# EAGLE design 6_channel_remote (EAGLE 9.5.1)
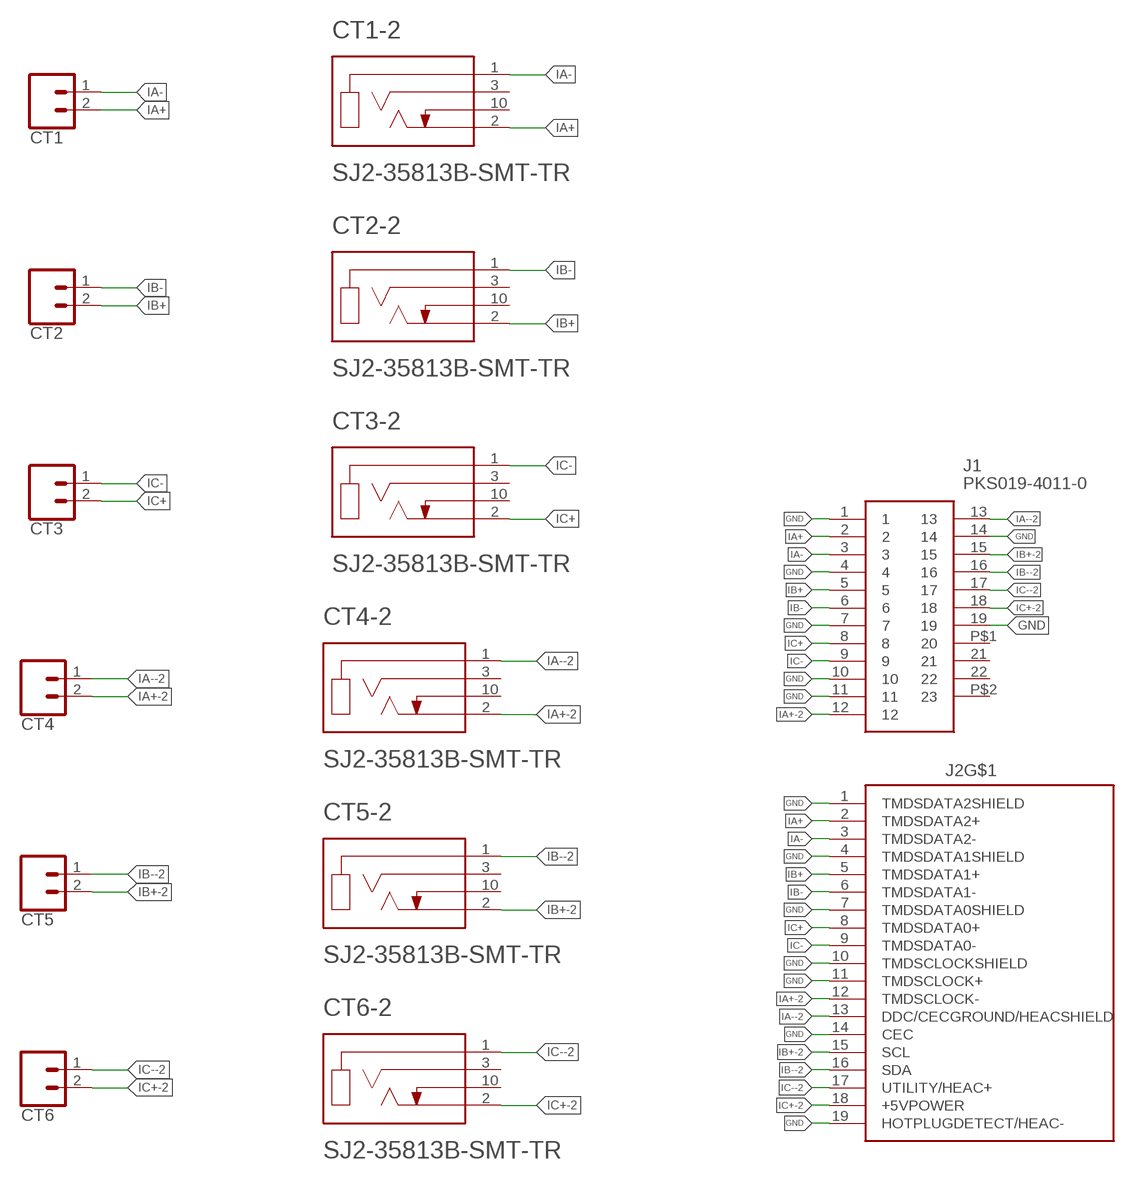
[diagram p0: schematic, sheet 1]

## Parts
CT1  CONN_023.5MM  [SCREWTERMINAL-3.5MM-2]
CT1-2  SJ2-35813B-SMT-TR  [CUI_SJ2-35813B-SMT-TR]
CT2  CONN_023.5MM  [SCREWTERMINAL-3.5MM-2]
CT2-2  SJ2-35813B-SMT-TR  [CUI_SJ2-35813B-SMT-TR]
CT3  CONN_023.5MM  [SCREWTERMINAL-3.5MM-2]
CT3-2  SJ2-35813B-SMT-TR  [CUI_SJ2-35813B-SMT-TR]
CT4  CONN_023.5MM  [SCREWTERMINAL-3.5MM-2]
CT4-2  SJ2-35813B-SMT-TR  [CUI_SJ2-35813B-SMT-TR]
CT5  CONN_023.5MM  [SCREWTERMINAL-3.5MM-2]
CT5-2  SJ2-35813B-SMT-TR  [CUI_SJ2-35813B-SMT-TR]
CT6  CONN_023.5MM  [SCREWTERMINAL-3.5MM-2]
CT6-2  SJ2-35813B-SMT-TR  [CUI_SJ2-35813B-SMT-TR]
J1  PKS019-4011-0  [PKS01940110]
J2  685119136923  [685119136923]

## Nets
GND: J1.1 J1.4 J1.7 J1.10 J1.11 J1.14 J1.19 J2.1(TMDSDATA2SHIELD) J2.4(TMDSDATA1SHIELD) J2.7(TMDSDATA0SHIELD) J2.10(TMDSCLOCKSHIELD) J2.11(TMDSCLOCK+) J2.14(CEC) J2.19(HOTPLUGDETECT/HEAC-)
IA+ [analog]: CT1-2.2(TIP) CT1.2 J1.2 J2.2(TMDSDATA2+)
IA+-2 [analog]: CT4-2.2(TIP) CT4.2 J1.12 J2.12(TMDSCLOCK-)
IA- [analog]: CT1-2.1(SLEEVE) CT1.1 J1.3 J2.3(TMDSDATA2-)
IA--2 [analog]: CT4-2.1(SLEEVE) CT4.1 J1.13 J2.13(DDC/CECGROUND/HEACSHIELD)
IB+ [analog]: CT2-2.2(TIP) CT2.2 J1.5 J2.5(TMDSDATA1+)
IB+-2 [analog]: CT5-2.2(TIP) CT5.2 J1.15 J2.15(SCL)
IB- [analog]: CT2-2.1(SLEEVE) CT2.1 J1.6 J2.6(TMDSDATA1-)
IB--2 [analog]: CT5-2.1(SLEEVE) CT5.1 J1.16 J2.16(SDA)
IC+ [analog]: CT3-2.2(TIP) CT3.2 J1.8 J2.8(TMDSDATA0+)
IC+-2 [analog]: CT6-2.2(TIP) CT6.2 J1.18 J2.18(+5VPOWER)
IC- [analog]: CT3-2.1(SLEEVE) CT3.1 J1.9 J2.9(TMDSDATA0-)
IC--2 [analog]: CT6-2.1(SLEEVE) CT6.1 J1.17 J2.17(UTILITY/HEAC+)
Unconnected: CT1-2.3(RING) CT1-2.10(TIP_SWITCH) CT2-2.3(RING) CT2-2.10(TIP_SWITCH) CT3-2.3(RING) CT3-2.10(TIP_SWITCH) CT4-2.3(RING) CT4-2.10(TIP_SWITCH) CT5-2.3(RING) CT5-2.10(TIP_SWITCH) CT6-2.3(RING) CT6-2.10(TIP_SWITCH) J1.21 J1.22 J1.P$1 J1.P$2 J2.SHELL1(SHIELD) J2.SHELL2(SHIELD) J2.SHELL3(SHIELD) J2.SHELL(SHIELD)

## Library data of the parts
CT1-CT6 = SparkFun-Connectors:CONN_02: Multi connection point. Often used as Generic Header-pin footprint for 0.1 inch spaced/style header connections On any of the 0.1 inch spaced packages, you can populate with these: Break Away Headers - Straight <https://www.sparkfun.com/products/116> (PRT-00116) Break Away Male Headers - Right Angle <https://www.sparkfun.com/products/553> (PRT-00553) Female Headers <https://www.sparkfun.com/products/115> (PRT-00115) Break Away Headers - Machine Pin <https://www.sparkfun.com/products/117> (PRT-00117) Break Away Female Headers - Swiss Machine Pin <https://www.sparkfun.com/products/743> (PRT-00743) For SCREWTERMINALS and SPRING TERMINALS visit here: Screw Terimnals on SparkFun.com <https://www.sparkfun.com/search/results?term=Screw+Terminals> (5mm/3.5mm/2.54mm spacing) This device is also useful as a general connection point to wire up your design to another part of your project. Our various solder wires solder well into these plated through hole pads. Hook-Up Wire - Assortment (Stranded, 22 AWG) <https://www.sparkfun.com/products/11375> (PRT-11375) Hook-Up Wire - Assortment (Solid Core, 22 AWG) <https://www.sparkfun.com/products/11367> (PRT-11367) View the entire wire category on our website here <https://www.sparkfun.com/categories/141> Special notes: Molex polarized connector foot print use with: PRT-08233 with associated crimp pins and housings. 2.54_SCREWTERM for use with PRT-10571. 3.5mm Screw Terminal footprints for PRT-08084 5mm Screw Terminal footprints for use with PRT-08432; PROD_ID: CONN-08399
CT1-2 CT2-2 CT3-2 CT4-2 CT5-2 CT6-2 = SJ2-35813B-SMT-TR:SJ2-35813B-SMT-TR: 3 conductors, 3.5mm, SMT Audio Jack w/ Tip Switch; MANUFACTURER: CUI; MPN: SJ2-35813B-SMT-TR; PART_REV: 1.01; STANDARD: Manufacturer recommendation
J1 = SamacSys_Parts:PKS019-4011-0: HDMI, Displayport & DVI Connectors Type D HDMI SMT Sngl Row Cnt Design Source: Datasheet <https://www.mouser.com/catalog/specsheets/PKS019-4011-0 Drawing.pdf>; DESCRIPTION: HDMI, Displayport & DVI Connectors Type D HDMI SMT Sngl Row Cnt Design; HEIGHT: 3.27mm; MANUFACTURER_NAME: Yamaichi; MANUFACTURER_PART_NUMBER: PKS019-4011-0; MOUSER_PART_NUMBER: 945-PKS019-4011-0; MOUSER_PRICE-STOCK: https://www.mouser.com/Search/Refine.aspx?Keyword=945-PKS019-4011-0
J2 = Wurth_Elektronik_Electromechanic_Input-Output_Connectors_rev19a:685119136923: WR-COM SMT Horizontal Mini HDMI, 19 pins=>Code : Con_I-O_COM_Mini-HDMI_685119136923 <http://katalog.we-online.de/media/images/eican/Con_I-O_COM_Mini-HDMI_685119136923_pf2.jpg> Details see: http://katalog.we-online.de/en/em/COM_MINI_SMT_HORIZONTAL/685119136923 Created 2014-07-09, Karrer Zheng 2014 (C) Würth Elektronik

## Net classes
0 default: width 0.152 mm, drill 0.33 mm, clearance 0.152 mm
2 analog: width 0.203 mm, drill 0.33 mm, clearance 0.152 mm

## Board
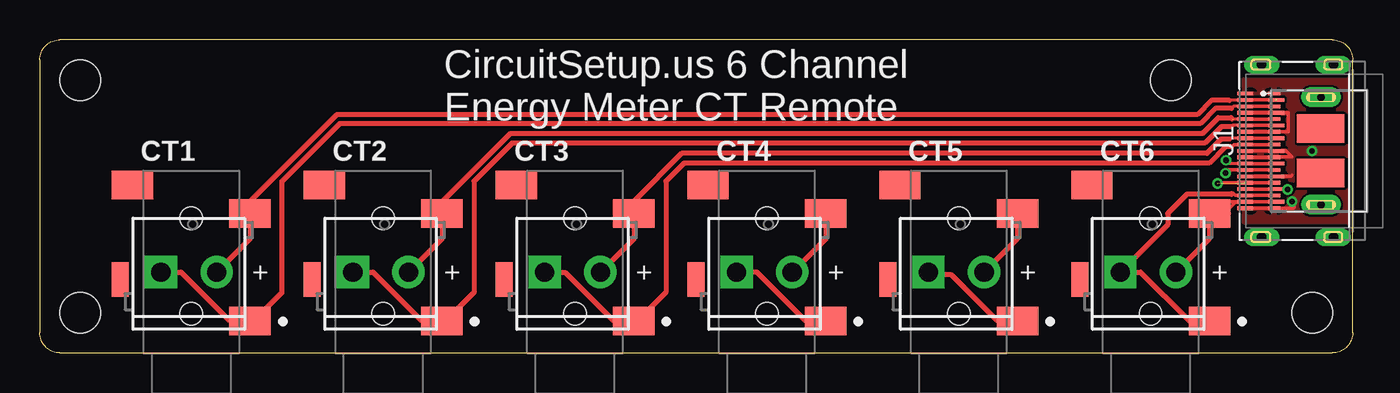
[diagram p1: board, top side]
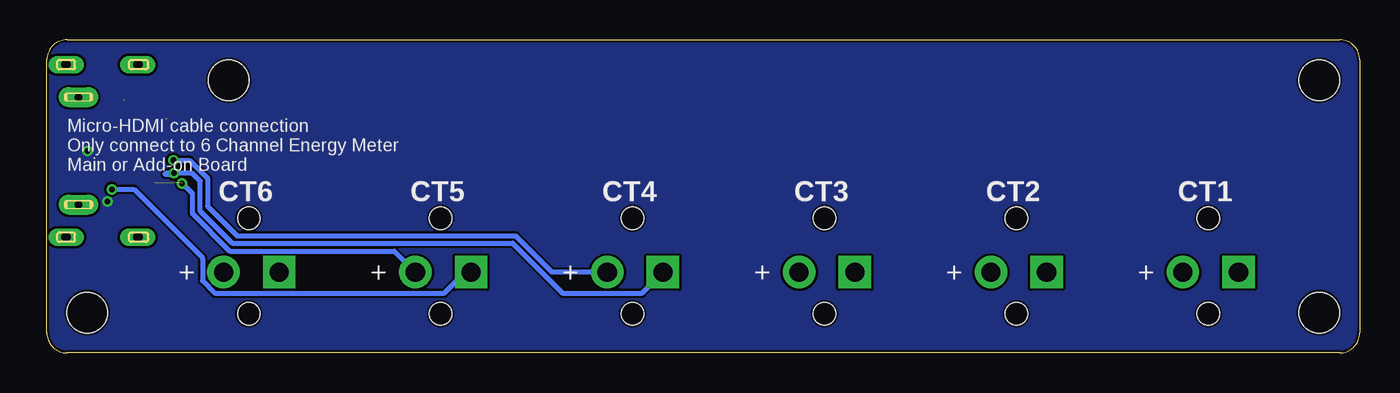
[diagram p2: board, bottom side, seen from below]

Size 82.55 x 19.68 mm. Coordinates in mm from the lower left corner, seen from the top.
Outline: 1.27,0 81.28,0 arc90 82.55,1.27 82.55,18.41 arc90 81.28,19.68 1.27,19.68 arc90 0,18.41 0,1.27 arc90 1.27,0
Copper layers (1*16): Top 0.035mm / dielectric 1.5mm / Bottom 0.035mm
Design rules "default *": minimum track width 6mil, minimum drill 0.3mm, track to track 6mil, track to pad 6mil, pad to pad 6mil, via to via 6mil, smd to smd 0mil, copper to edge 6mil, drill to drill 6mil, minimum pad ring 10mil, minimum via ring 6mil, stop-mask expansion 4mil, vias tented up to drill 25mil, thermal gap 10mil
Holes 2.54 mm at 71.12,17.14 80.01,2.54 2.54,17.14 2.54,2.54

### Footprints (pad centres in the part's own frame; a part is rotated, then mirrored left to right if it is on the bottom)
SCREWTERMINAL-3.5MM-2 = drill 1.2 pad 2.032 square: 1 0,0 | drill 1.2 pad 2.032: 2 3.5,0
CUI_SJ2-35813B-SMT-TR = smd 1.8 x 2.6: 1 -3.7,-3.7; 2 3.05,-3.7; 10 4.85,3.7 | smd 2.184 x 1.067: 3 -1.1,4.462 | hole 1.4: -3.25,0; 2.75,0
PKS01940110 = smd 0.23 x 0.75: 1 3.6,5.825; 3 2.8,5.825; 5 2,5.825; 7 1.2,5.825; 9 0.4,5.825; 11 -0.4,5.825; 13 -1.2,5.825; 15 -2,5.825; 17 -2.8,5.825; 19 -3.6,5.825 | smd 0.23 x 1: 2 3.2,5.7; 4 2.4,5.7; 6 1.6,5.7; 8 0.8,5.7; 10 0,5.7; 12 -0.8,5.7; 14 -1.6,5.7; 16 -2.4,5.7; 18 -3.2,5.7 | smd 1.8 x 3: 21 -1.4,2.9; 22 1.4,2.9 | drill 0.5 pad 1.25 long: P$1 -3.375,2.875; P$2 3.375,2.875
685119136923 = smd 0.23 x 1: 1 3.6,1.05; 2 3.2,1.05; 3 2.8,1.05; 4 2.4,1.05; 5 2,1.05; 6 1.6,1.05; 7 1.2,1.05; 8 0.8,1.05; 9 0.4,1.05; 10 0,1.05; 11 -0.4,1.05; 12 -0.8,1.05; 13 -1.2,1.05; 14 -1.6,1.05; 15 -2,1.05; 16 -2.4,1.05; 17 -2.8,1.05; 18 -3.2,1.05; 19 -3.6,1.05 | drill 0.6 long: SHELL -5.425,0; SHELL1 5.425,0; SHELL2 -5.425,-4.5; SHELL3 5.425,-4.5

### Placement (x,y rotation side)
CT1  7.62,5.08 0 top
CT1-2  9.53,5.71 90 top
CT2  19.68,5.08 0 top
CT2-2  21.59,5.71 90 top
CT3  31.75,5.08 0 top
CT3-2  33.66,5.71 90 top
CT4  43.81,5.08 0 top
CT4-2  45.72,5.71 90 top
CT5  55.88,5.08 0 top
CT5-2  57.78,5.71 90 top
CT6  67.94,5.08 0 top
CT6-2  69.85,5.71 90 top
J1  83.44,12.7 90 top
J2  76.83,12.7 90 top

### Tracks (layer width: path | path; a pad name or v marks a point on that pad's centre or on a via)
GND  (via drill 0.35)
  Top 0.229: 78.74,11.18 78.66,11.1 J1.14 J2.14 | 78.87,9.14 78.82,9.1 J1.19 J2.19 | J2.4 J1.4 77.75,15.11 78.49,15.11 78.51,15.09 78.51,13.92 77.63,13.92 J1.7 J2.7 | J2.10 J1.10 78.36,12.7 78.74,12.32 77.63,12.32 J1.11 J2.11
  other vias: 78.74,9.53 80.01,12.7
  pour Bottom: -0.64,20.32 83.19,20.32 83.19,-0.64 -0.64,-0.64
  pour Top: 75.69,17.14 75.69,8.26 83.19,8.26 83.19,17.14
IA+  (2 unrouted)
  Top 0.203: 13.62,8.77 CT1-2.2 | J1.2 77.71,15.88 74.8,15.88
  Top 0.229: J2.2 77.69,15.9 77.71,15.88 | 77.47,15.88 77.71,15.88
  Top 0.305: CT1.2 13.22,7.18 CT1-2.2 13.22,9.54 18.67,14.99 72.77,14.99 73.66,15.88 74.8,15.88
IA+-2  (via drill 0.35)
  Top 0.203: J1.12 74.81,11.9 v74.6,12.11
  Top 0.229: J2.12 J1.12
  Top 0.305: CT4-2.2 49.42,7.18 CT4.2
  Bottom 0.305: CT4.2 50.79,5.08 53.07,7.37 70.59,7.37 72.45,9.23 72.45,10.99 73.34,11.88 73.35,11.88 73.58,12.11 v74.6,12.11 74.4,12.11
IA-
  Top 0.203: J1.3 75.06,15.5 74.93,15.37
  Top 0.229: J2.3 J1.3
  Top 0.305: CT1.1 8.89,5.08 11.96,2.02 CT1-2.1 13.45,2.02 15.24,3.81 15.24,10.79 18.86,14.42 72.96,14.42 73.91,15.37 74.93,15.37
IA--2  (via drill 0.35)
  Top 0.229: v74.55,11.3 74.55,11.32 74.73,11.5 J1.13 J2.13
  Top 0.305: CT4-2.1 48.15,2.02 45.09,5.08 CT4.1
  Bottom 0.305: CT4.1 45.14,3.76 50.11,3.76 53.26,6.91 70.91,6.91 72.91,8.91 72.91,10.8 73.4,11.29 75.06,11.29 75.12,11.24 74.61,11.24 v74.55,11.3
IB+  (1 unrouted)
  Top 0.203: 25.29,9.51 CT2-2.2 | J1.5 75.09,14.7
  Top 0.229: J2.5 J1.5
  Top 0.305: CT2-2.2 25.29,7.18 CT2.2 | 25.29,9.51 29.57,13.79 73.1,13.79 74.1,14.8 74.89,14.8 74.98,14.71
IB+-2  (via drill 0.35)  (1 unrouted)
  Top 0.229: v74.05,10.66 74.08,10.7 J1.15
  Top 0.305: CT5-2.2 61.48,7.18 CT5.2
  Bottom 0.305: CT5.2 60.7,6.4 71.04,6.4 73.41,8.77 73.41,10.03 v74.05,10.66
IB-
  Top 0.203: J1.6 77.47,14.3 75.01,14.3 74.93,14.22
  Top 0.229: J2.6 77.47,14.3
  Top 0.305: CT2.1 20.95,5.08 24.02,2.02 CT2-2.1 25.51,2.02 27.3,3.81 27.3,10.79 29.7,13.19 73.26,13.19 74.3,14.22 74.93,14.22
IB--2  (via drill 0.35)  (1 unrouted)
  Top 0.229: v78.47,10.29 78.46,10.3 J1.16 J2.16
  Top 0.305: CT5-2.1 60.22,2.02 57.33,4.9 56.06,4.9 CT5.1
  Bottom 0.305: CT5.1 56.24,5.08 57.56,3.76 71.99,3.76 72.77,4.53 72.77,5.98 77.07,10.29 v78.47,10.29
IC+
  Top 0.203: 37.35,9.54 CT3-2.2 | J1.8 74.84,13.5 74.8,13.46
  Top 0.229: J2.8 J1.8
  Top 0.305: CT3-2.2 37.35,7.18 CT3.2 | 37.35,9.54 40.36,12.55 73.38,12.55 74.3,13.46 74.8,13.46
IC+-2
  Top 0.229: J1.18 74.82,9.5 74.59,9.27 74.06,9.27 | J2.18 75.77,9.48 75.17,9.48 74.46,8.77 CT6-2.2
  Top 0.305: CT6-2.2 73.55,7.18 CT6.2 | 74.73,8.77 CT6-2.2 | CT6-2.2 74.06,9.27
IC-
  Top 0.203: J1.9 77.47,13.1 75.08,13.1 74.93,12.95
  Top 0.229: 77.47,13.1 J2.9 75.08,13.1
  Top 0.305: CT3.1 31.8,5.03 33.07,5.03 36.09,2.02 CT3-2.1 37.58,2.02 39.37,3.81 39.37,10.8 40.51,11.94 73.53,11.94 74.55,12.95 74.93,12.95
IC--2
  Top 0.229: 74.93,10.03 75.05,10.03 75.17,9.9 J2.17 J1.17
  Top 0.305: CT6-2.1 72.28,2.02 69.22,5.08 CT6.1 70.93,8.06 70.93,8.78 72.12,9.97 74.93,9.97 74.93,10.03

### Text on the board
tPlace: CircuitSetup.us 6 Channel / Energy Meter CT Remote | + | + | + | + | + | +
bPlace: Micro-HDMI cable connection / Only connect to 6 Channel Energy Meter / Main or Add-on Board | CT1 | CT2 | CT3 | CT4 | CT5 | CT6 | + | + | + | + | + | +